# Altium project 复合信号发生器.PrjPcb
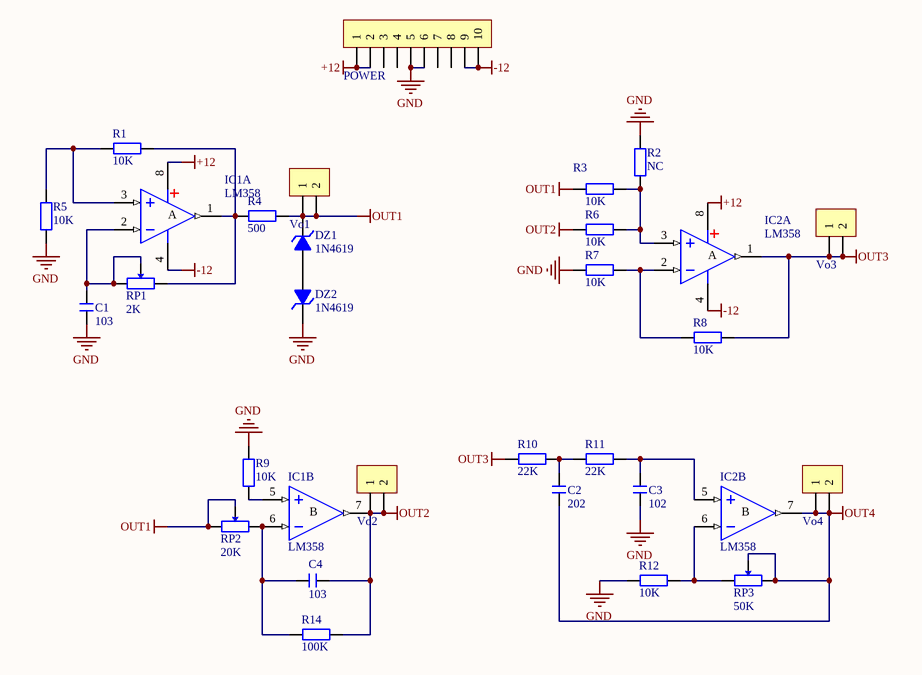
[diagram p0: Sheet1.SchDoc]
1 sheet, 29 parts. Net scope: global (net labels, ports and power ports of the same name join across sheets).
Board file: PCB1.PcbDoc

## Sheet Sheet1.SchDoc
size A4; Organization: Altium Limited; Address1: L3, 12a Rodborough Rd; Address2: Frenchs Forest; Address3: NSW; Address4: Australia 2086

### Parts
C1  103  [C 0805_L]
C2  202  [C 0805_L]
C3  102  [C 0805_L]
C4  103  [C 0805_L]
DZ1  1N4619  [DO-35]
DZ2  1N4619  [DO-35]
IC1  LM358  [SOP8_N]  (parts A,B of 2)
IC2  LM358  [SOP8_N]  (parts A,B of 2)
POWER  HDR-1X10  [HDR2.54-LI-10P]  (value not drawn)
R1  10K  [R 0805_L]
R2  NC  [R 0805_L]
R3  10K  [R 0805_L]
R4  500  [R 0805_L]
R5  10K  [R 0805_L]
R6  10K  [R 0805_L]
R7  10K  [R 0805_L]
R8  10K  [R 0805_L]
R9  10K  [R 0805_L]
R10  22K  [R 0805_L]
R11  22K  [R 0805_L]
R12  10K  [R 0805_L]
R14  100K  [R 0805_L]
RP1  2K  [3296W]
RP2  20K  [3296W]
RP3  50K  [3296W]
Vo1  HDR-1X2  [HDR2.54-LI-2P]  (value not drawn)
Vo2  HDR-1X2  [HDR2.54-LI-2P]  (value not drawn)
Vo3  HDR-1X2  [HDR2.54-LI-2P]  (value not drawn)
Vo4  HDR-1X2  [HDR2.54-LI-2P]  (value not drawn)

### Nets
+12: IC1.8(V+) IC2.8(V+) POWER.1 POWER.2
-12: IC1.4(V-) IC2.4(V-) POWER.9 POWER.10
GND: C1.1 C3.2 DZ2.2(K) POWER.5 POWER.6 R2.1 R5.1 R7.2 R9.2 R12.2
OUT1: DZ1.2(K) R3.2 R4.1 RP2.1 RP2.2 Vo1.1 Vo1.2
OUT2: C4.1 IC1.7(OUT) R6.2 R14.1 Vo2.1 Vo2.2
OUT3: IC2.1(OUT) R8.1 R10.2 Vo3.1 Vo3.2
OUT4: C2.2 IC2.7(OUT) RP3.2 RP3.3 Vo4.1 Vo4.2
NetC1_2: C1.2 IC1.2(IN-) RP1.1 RP1.2
NetC2_1: C2.1 R10.1 R11.2
NetC3_1: C3.1 IC2.5(IN+) R11.1
NetC4_2: C4.2 IC1.6(IN-) R14.2 RP2.3
NetDZ1_1: DZ1.1(A) DZ2.1(A)
NetIC1_1: IC1.1(OUT) R1.1 R4.2 RP1.3
NetIC1_3: IC1.3(IN+) R1.2 R5.2
NetIC1_5: IC1.5(IN+) R9.1
NetIC2_2: IC2.2(IN-) R7.1 R8.2
NetIC2_3: IC2.3(IN+) R2.2 R3.1 R6.1
NetIC2_6: IC2.6(IN-) R12.1 RP3.1

Not connected (* = marked no-connect by the designer): POWER 3 4 7 8

### Notes on the sheet
- Title
- Size:
- Date:
- A4
- Number:
- Time:
- Revision:
- Sheet
- of
- File:
- (in symbol LM358, part A) A
- (in symbol LM358, part B) B

### Library data of the parts
C1-C4 = C: 无极性贴片电容; 版权归属: 源创客; BOM名称: 无极性贴片电容; 学习资源: www.ooocke.com
DZ1 DZ2 = 1N4619: 3V/0.5W稳压管; 版权归属: 源创客; BOM名称: 3V/0.5W稳压管; 学习资源: www.ooocke.com
IC1 IC2 = LM358: 双路运放; 版权归属: 源创客; BOM名称: 双路运放; 学习资源: www.ooocke.com
POWER = Header 10: 10P接插件; 版权归属: 源创客; BOM名称: 10P接插件; 学习资源: www.ooocke.com
R1-R12 R14 = R: 贴片电阻; 版权归属: 源创客; BOM名称: 贴片电阻; 学习资源: www.ooocke.com
RP1-RP3 = RP-ID: 插件单联电位器; BOM名称: 插件电位器; 版权归属: 源创客; 学习资源: www.ooocke.com
Vo1-Vo4 = Header 2: 2P接插件; 版权归属: 源创客; BOM名称: 2P接插件; 学习资源: www.ooocke.com